# EAGLE design MCPAmplifier (EAGLE 9.0.1)
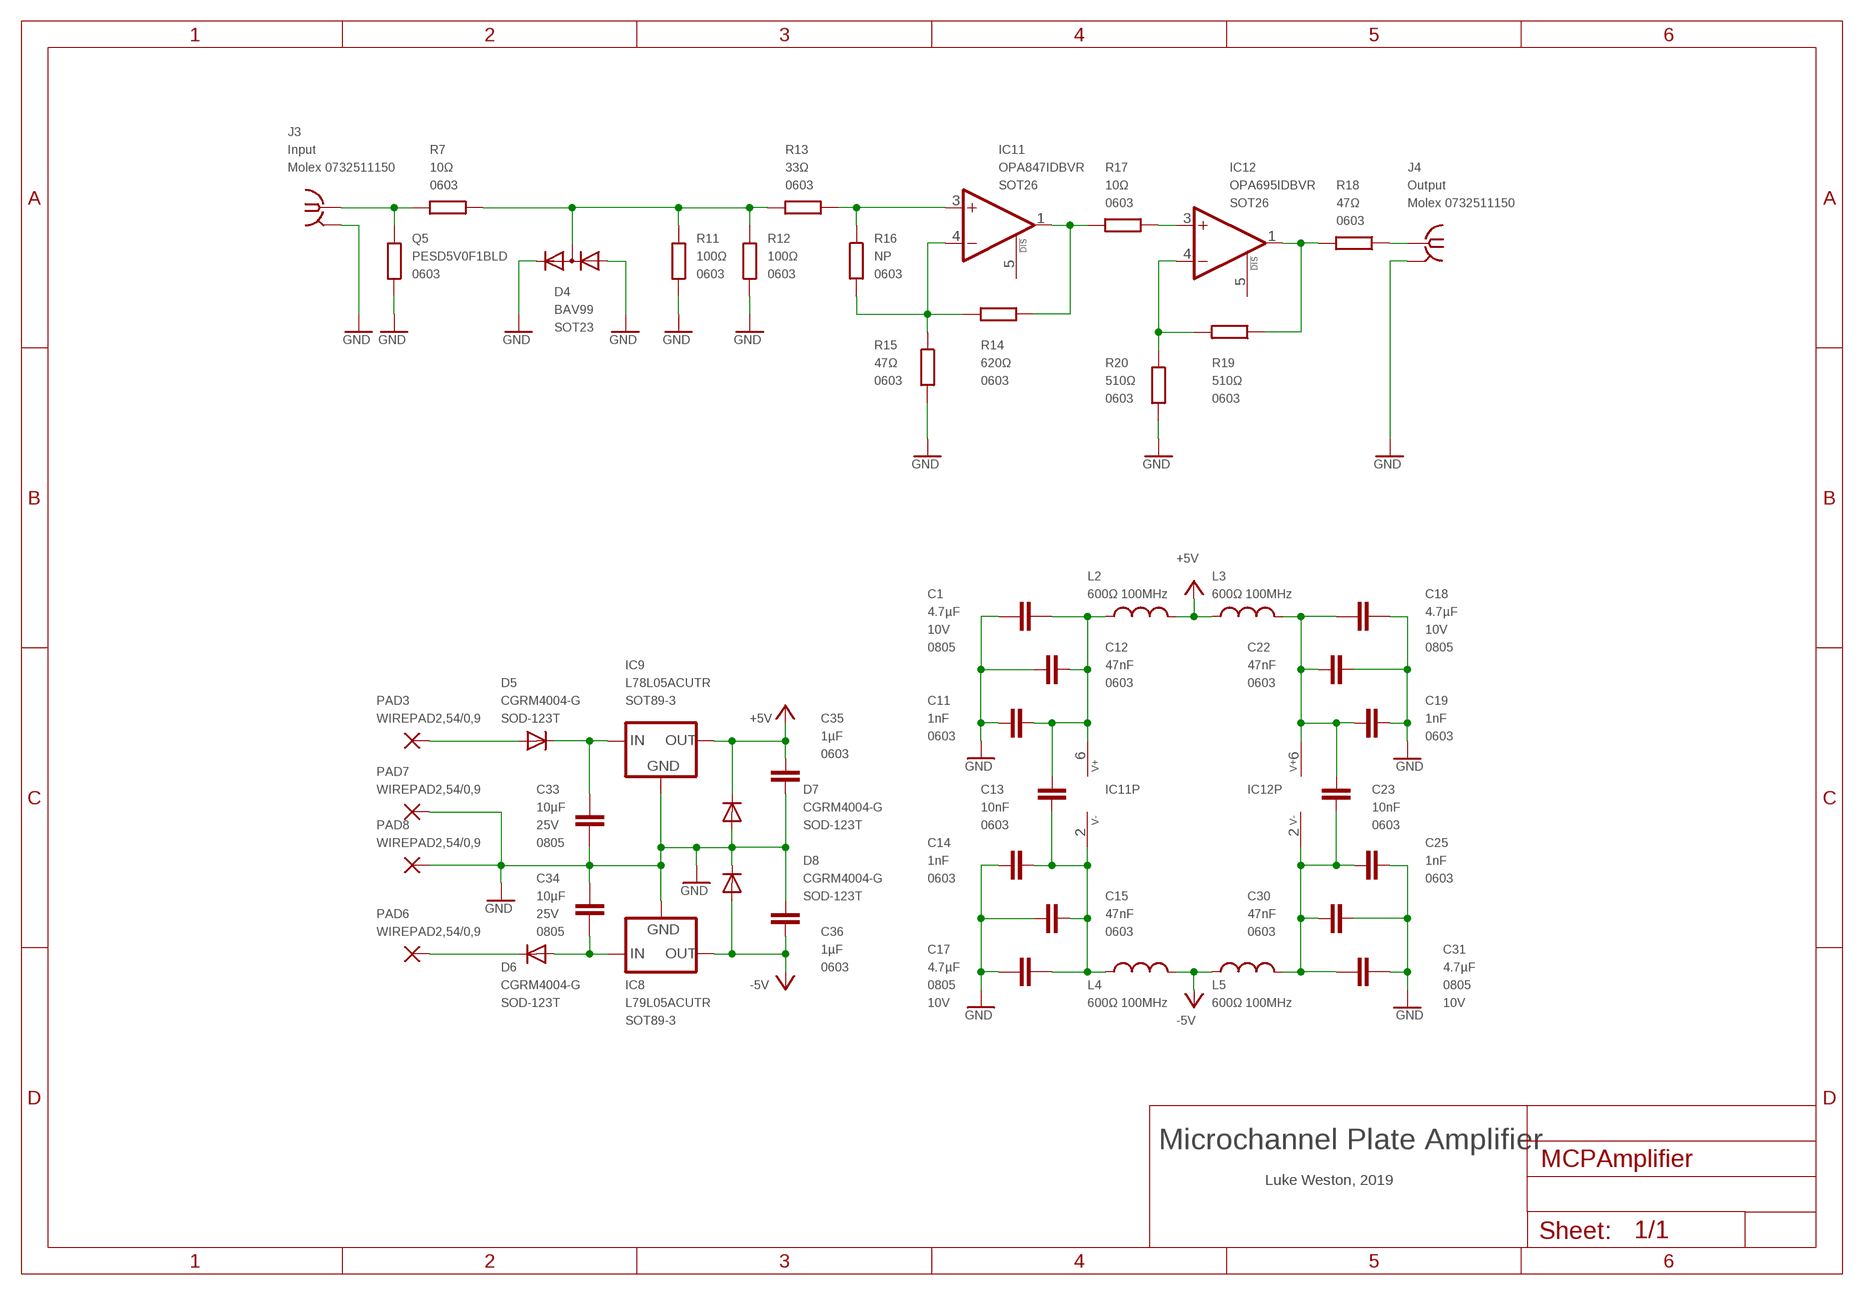
[diagram p0: schematic, sheet 1]

## Parts
C1  4.7µF  CAP0805  [0805]
C11  1nF  C0603  [0603]
C12  47nF  C0603  [0603]
C13  10nF  C0603  [0603]
C14  1nF  C0603  [0603]
C15  47nF  C0603  [0603]
C17  4.7µF  CAP0805  [0805]
C18  4.7µF  CAP0805  [0805]
C19  1nF  C0603  [0603]
C22  47nF  C0603  [0603]
C23  10nF  C0603  [0603]
C25  1nF  C0603  [0603]
C30  47nF  C0603  [0603]
C31  4.7µF  CAP0805  [0805]
C33  10µF  CAP0805  [0805]
C34  10µF  CAP0805  [0805]
C35  1µF  C0603  [0603]
C36  1µF  C0603  [0603]
D4  BAV99  BAV199  [SOT23]
D5  CGRM4004-G  [SOD-123_MINI-SMA]
D6  CGRM4004-G  [SOD-123_MINI-SMA]
D7  CGRM4004-G  [SOD-123_MINI-SMA]
D8  CGRM4004-G  [SOD-123_MINI-SMA]
IC8  L79L05ACUTR  79LXX-SOT89  [SOT89]
IC9  L78L05ACUTR  78LXX-SOT89  [SOT89]
IC11  OPA847IDBVR  OPA847DBV  [SOT23-6]
IC12  OPA695IDBVR  OPA847DBV  [SOT23-6]
J3  Input  SMA-142-0701-881/886  [J502-ND-142-0701-881/886]
J4  Output  SMA-142-0701-881/886  [J502-ND-142-0701-881/886]
L2  600Ω 100MHz  0402INDUCTOR  [0603]
L3  600Ω 100MHz  0402INDUCTOR  [0603]
L4  600Ω 100MHz  0402INDUCTOR  [0603]
L5  600Ω 100MHz  0402INDUCTOR  [0603]
PAD3  WIREPAD2,54/0,9  [2,54/0,9]
PAD6  WIREPAD2,54/0,9  [2,54/0,9]
PAD7  WIREPAD2,54/0,9  [2,54/0,9]
PAD8  WIREPAD2,54/0,9  [2,54/0,9]
Q5  PESD5V0F1BLD  R0603  [0603]
R7  10Ω  R0603  [0603]
R11  100Ω  R0603  [0603]
R12  100Ω  R0603  [0603]
R13  33Ω  R0603  [0603]
R14  620Ω  R0603  [0603]
R15  47Ω  R0603  [0603]
R16  NP  R0603  [0603]
R17  10Ω  R0603  [0603]
R18  47Ω  R0603  [0603]
R19  510Ω  R0603  [0603]
R20  510Ω  R0603  [0603]

## Nets
+5V: C35.1 D7.C IC9.1(OUT) L2.2 L3.1
-5V: C36.2 D8.A IC8.3(OUT) L4.2 L5.1
GND: C1.2 C11.2 C12.2 C14.2 C15.2 C17.2 C18.2 C19.2 C22.2 C25.2 C30.2 C31.2 C33.1 C34.2 C35.2 C36.1 D4.1(A) D4.2(C) D7.A D8.C IC8.1(GND) IC9.2(GND) J3.G@1 J3.G@2 J3.G@3 J3.G@4 J4.G@1 J4.G@2 J4.G@3 J4.G@4 PAD7.1(P) PAD8.1(P) Q5.1 R11.1 R12.1 R15.2 R20.2
N$8: C13.2 C14.1 C15.1 C17.1 IC11.2(P:V-) L4.1
N$13: D4.3(AC) R7.2 R11.2 R12.2 R13.2
N$14: J3.1 Q5.2 R7.1
N$15: IC11.3(+IN) R13.1 R16.1
N$16: IC11.4(-IN) R14.2 R15.1 R16.2
N$17: IC11.1(OUT) R14.1 R17.2
N$18: IC12.3(+IN) R17.1
N$19: IC12.4(-IN) R19.2 R20.1
N$20: IC12.1(OUT) R18.2 R19.1
N$21: J4.1 R18.1
N$23: C1.1 C11.1 C12.1 C13.1 IC11.6(P:V+) L2.1
N$25: C18.1 C19.1 C22.1 C23.1 IC12.6(P:V+) L3.2
N$26: C23.2 C25.1 C30.1 C31.1 IC12.2(P:V-) L5.2
N$27: D5.A PAD3.1(P)
N$28: C33.2 D5.C IC9.3(IN)
N$30: D6.C PAD6.1(P)
N$31: C34.1 D6.A IC8.2(IN)
Unconnected: IC11.5(DIS) IC12.5(DIS)

## Notes on the sheet
- Microchannel Plate Amplifier
- Luke Weston, 2019

## Library data of the parts
C1 C17 C18 C31 = IRSensor:CAP: Capacitor Standard 0603 ceramic capacitor, and 0.1" leaded capacitor.; PACKAGE: 0805; VOLTAGE: 10V
C11-C15 C19 C22 C23 C25 C30 C35 C36 = IRSensor:C; PACKAGE: 0603
C33 C34 = IRSensor:CAP: Capacitor Standard 0603 ceramic capacitor, and 0.1" leaded capacitor.; PACKAGE: 0805; VOLTAGE: 25V
D4 = diode:BAV199: DIODE low-leakage double diode; PACKAGE: SOT23
D5-D8 = diode:CGRM400*-G: Molded plasitc,JEDEC SOD-123/Mini SMA Source: Comchip CGRM4001-G.pdf; PACKAGE: SOD-123T
IC8 = v-reg-3:79LXX: VOLTAGE REGULATOR; PACKAGE: SOT89-3
IC9 = v-reg-3:78LXX: VOLTAGE REGULATOR; PACKAGE: SOT89-3
IC11 IC12 = op-amp:OPA847: OP-AMP Wideband, Ultra-Low Noise, Voltage-Feedback with Shutdown; PACKAGE: SOT26
J3 J4 = IRSensor:SMA-: SMA 50 Ohm End Launch Jack Receptacle - Round Contact Johnson Components Source: www.johnsoncomponents.com .. J502-ND.pdf; MF: JOHNSON COMPONENTS; MPN: 142-0701-881; OC_FARNELL: 1608603; OC_NEWARK: 08B906; SKU: Molex 0732511150
L2-L5 = freetronics-luke:0402INDUCTOR
PAD3 PAD6-PAD8 = IRSensor:WIREPAD: Wire PAD connect wire on PCB
Q5 R7 R11-R20 = IRSensor:R; PACKAGE: 0603

## Board
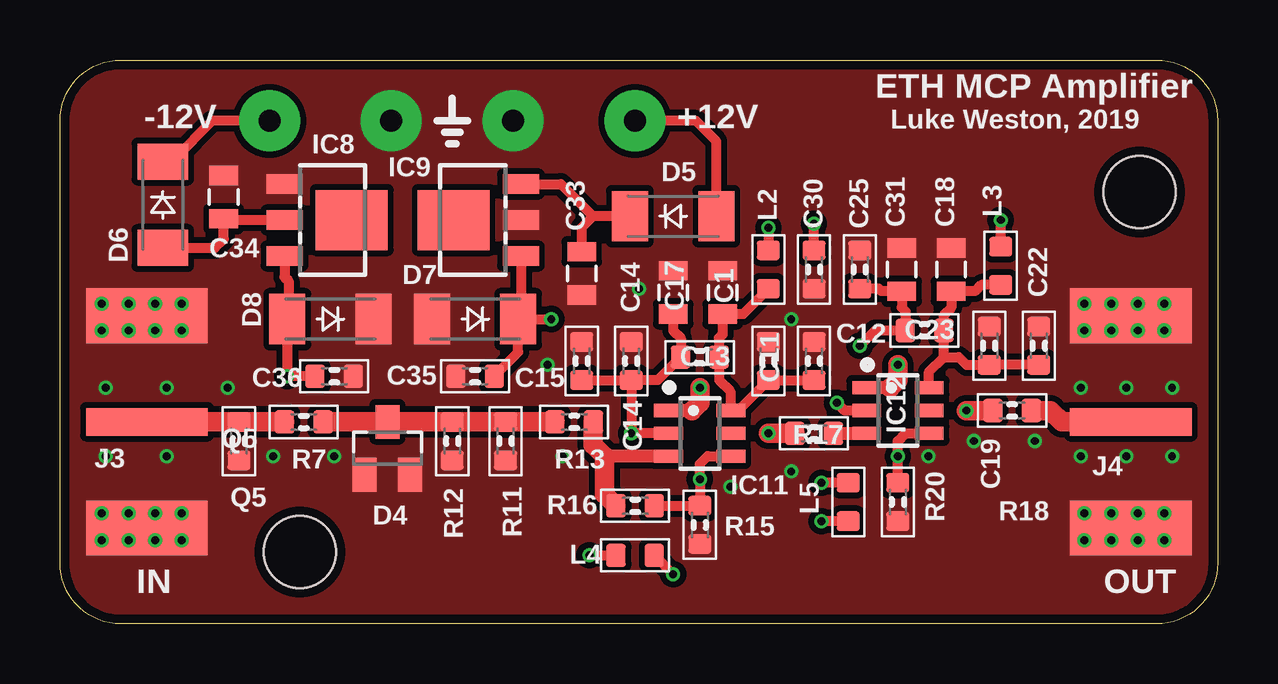
[diagram p1: board, top side]
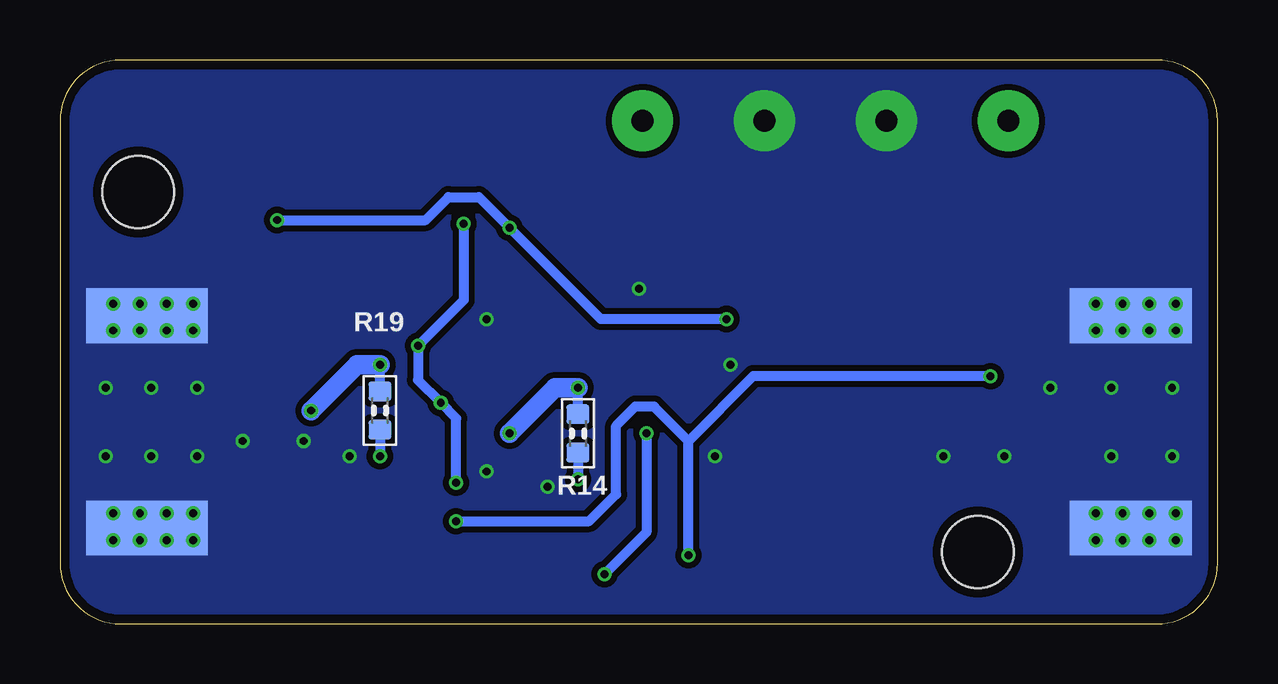
[diagram p2: board, bottom side, seen from below]

Size 48.26 x 23.5 mm. Coordinates in mm from the lower left corner, seen from the top.
Outline: 2.54,23.5 45.72,23.5 arc-90 48.26,20.95 48.26,2.54 arc-90 45.72,0 2.54,0 arc-90 0,2.54 0,20.95 arc-90 2.54,23.5
Copper layers (1*16): Top 0.035559375mm / dielectric 1.6mm / Bottom 0.035559375mm
Design rules "oshpark-2layer-tented": minimum track width 6mil, minimum drill 10mil, track to track 6mil, track to pad 6mil, pad to pad 6mil, via to via 6mil, smd to smd 6mil, copper to edge 15mil, drill to drill 6mil, minimum pad ring 5mil, minimum via ring 5mil, stop-mask expansion 2.5mil, vias tented up to drill 20mil, thermal gap 10mil
Holes 3 mm at 10,3 45,18

### Footprints (pad centres in the part's own frame; a part is rotated, then mirrored left to right if it is on the bottom)
0805 = smd 0.8 x 1.2: 1 -0.9,0; 2 0.9,0
0603 = smd 0.8 x 0.95: 1 -0.8,0; 2 0.8,0
SOT23 = smd 1 x 1.4: 1 -0.95,-1.1; 2 0.95,-1.1; 3 0,1.1
SOD-123_MINI-SMA = smd 1.5 x 2.1: A 1.8,0; C -1.8,0
SOT89 = smd 0.8 x 1.5: 1 -1.5,-1.75; 2 0,-1.75; 3 1.5,-1.75 | smd 2.5 x 3: 4 0,1.05
SOT23-6 = smd 0.55 x 1.2: 1 -0.95,-1.3; 2 0,-1.3; 3 0.95,-1.3; 4 0.95,1.3; 5 0,1.3; 6 -0.95,1.3
J502-ND-142-0701-881/886 = smd 5.08 x 1.143: 1 2.565,0 | smd 5.08 x 2.286: G@1 2.565,4.42; G@2 2.565,-4.42 | smd 5.08 x 2.286 bottom: G@3 2.565,4.42; G@4 2.565,-4.42
2,54/0,9 = drill 0.914 pad 2.54: 1 0,0

### Placement (x,y rotation side)
C1  27.62,13.81 90 top
C11  29.53,10.95 90 top
C12  31.43,10.95 90 top
C13  26.67,11.11 180 top
C14  23.81,10.95 90 top
C15  21.75,10.95 90 top
C17  25.56,13.81 90 top
C18  37.15,14.76 90 top
C19  38.73,11.59 90 top
C22  40.8,11.59 90 top
C23  36.04,12.22 180 top
C25  33.34,14.76 90 top
C30  31.43,14.76 270 top
C31  35.08,14.76 90 top
C33  21.75,14.61 90 top
C34  6.83,17.78 90 top
C35  17.3,10.32 180 top
C36  11.43,10.32 180 top
D4  13.65,7.31 0 top
D5  25.56,16.99 0 top
D6  4.29,17.46 270 top
D7  17.3,12.7 180 top
D8  11.27,12.7 180 top
IC8  11.11,16.83 270 top
IC9  17.46,16.83 90 top
IC11  26.67,7.94 270 top
IC12  34.92,8.89 270 top
J3  6.19,8.41 180 top
J4  42.07,8.41 0 top
L2  29.53,14.76 90 top
L3  39.21,14.92 270 top
L4  23.97,2.86 180 top
L5  32.86,5.08 90 top
PAD3  23.97,20.95 270 top
PAD6  8.73,20.95 270 top
PAD7  18.89,20.95 270 top
PAD8  13.81,20.95 270 top
Q5  7.46,7.61 90 top
R7  10.16,8.41 0 top
R11  18.57,7.61 90 top
R12  16.35,7.61 90 top
R13  21.43,8.41 180 top
R14  26.67,7.94 270 bottom
R15  26.67,4.13 270 top
R16  23.97,4.92 0 top
R17  31.43,7.94 180 top
R18  39.69,8.89 180 top
R19  34.92,8.89 270 bottom
R20  34.92,5.08 270 top

### Tracks (layer width: path | path; a pad name or v marks a point on that pad's centre or on a via)
+5V  (via drill 0.33)
  Top 0.254: 19.21,12.81 D7.C
  Top 0.406: IC9.1 19.21,12.81 | C35.1 19.1,11.32 D7.C v20.48,12.7 | v29.53,16.51 L2.2 | L3.1 v39.21,16.83
  Bottom 0.254: v29.52,16.51 v29.53,16.51
  Bottom 0.406: v39.21,16.83 33.02,16.83 32.07,17.78 30.8,17.78 v29.52,16.51 25.72,12.7 v20.48,12.7
-5V  (via drill 0.33)
  Top 0.254: 9.53,12.75 D8.A
  Top 0.406: IC8.3 9.36,14.45 9.53,14.29 9.53,12.75 | C36.2 v9.47,10.32 D8.A | v22.07,2.86 L4.2 | L5.1 v31.74,4.28
  Bottom 0.254: v31.74,4.29 v31.74,4.28
  Bottom 0.406: v31.74,4.28 26.2,4.28 25.08,5.4 25.08,8.26 24.29,9.05 23.5,9.05 22.07,7.62 | v9.47,10.32 19.37,10.32 22.07,7.62 | v22.07,2.86 22.07,7.62
GND  (via drill 0.33)
  other vias: 1.75,4.6 1.75,3.49 2.86,3.49 2.86,4.6 3.97,4.6 5.08,4.6 5.08,3.49 3.97,13.34 1.75,13.34 1.75,12.22 2.86,12.22 2.86,13.34 3.97,12.22 5.08,13.34 5.08,12.22 3.97,3.49 42.7,13.34 42.7,12.22 43.81,12.22 43.81,13.34 44.93,13.34 44.93,12.22 46.04,13.34 46.04,12.22 42.7,3.49 42.7,4.6 43.81,4.6 43.81,3.49 44.93,3.49 44.93,4.6 46.04,4.6 46.04,3.49 30.48,12.7 30.48,6.35 27.94,5.71 36.2,6.99 38.1,7.62 40.64,7.62 42.55,9.84 42.55,6.99 44.45,6.99 44.45,9.84 46.35,9.84 46.35,6.99 24.13,13.97 20.32,10.79 20.95,6.99 8.89,6.99 11.43,6.99 6.99,9.84 4.45,9.84 4.45,6.99 1.91,6.99 1.91,9.84
  pour Top (isolate 0.254, no thermals): 0,23.5 48.26,23.5 48.26,0 0,0
  pour Bottom (isolate 0.254, no thermals): 0,0 48.26,0 48.26,23.5 0,23.5
N$8  (via drill 0.33)
  Top 0.254: C13.2 | L4.1
  Top 0.406: C15.1 C14.1 | C13.2 24.91,10.15 C14.1 | C17.1 25.56,12.22 25.88,11.91 C13.2 | L4.1 v25.56,2.06 | IC11.2 v23.81,7.94 C14.1
  Bottom 0.406: v23.81,7.94 23.81,3.81 v25.56,2.06
N$13
  Top 0.254: R12.2 16.67,8.41 | 11.12,8.41 R7.2
  Top 0.813: 16.67,8.41 R11.2 R13.2 | 11.12,8.41 D4.3 16.67,8.41
N$14
  Top 0.813: J3.1 Q5.2 R7.1
N$15
  Top 0.254: IC11.3 | R16.1 | R13.1 | 22.7,6.99
  Top 0.533: IC11.3 22.7,6.99
  Top 0.813: 22.7,6.99 22.23,7.46 R13.1 | R16.1 22.7,5.39 22.7,6.99
N$16  (via drill 0.33)
  Top 0.254: R15.1
  Top 0.406: IC11.4 26.99,6.99 26.67,6.67 v26.67,6.03 R15.1 | R16.2 R15.1
  Bottom 0.406: R14.2 v26.67,6.03
N$17  (via drill 0.33)
  Top 0.533: 26.35,8.89 IC11.1
  Top 0.813: v26.67,9.84 26.67,9.21 26.35,8.89 | v29.53,7.94 R17.2
  Bottom 0.406: R14.1 v26.67,9.84
  Bottom 0.813: v26.67,9.84 27.62,9.84 v29.53,7.94
N$18
  Top 0.254: IC12.3
  Top 0.533: R17.1 IC12.3
N$19  (via drill 0.33)
  Top 0.406: IC12.4 35.24,7.94 34.92,7.62 v34.92,6.99 R20.1
  Bottom 0.406: R19.2 v34.92,6.99
N$20  (via drill 0.33)
  Top 0.533: 34.6,9.84 IC12.1
  Top 0.813: v34.92,10.79 34.92,10.16 34.6,9.84 | R18.2 v37.78,8.89
  Bottom 0.406: R19.1 v34.92,10.79
  Bottom 0.813: v34.92,10.79 35.88,10.79 v37.78,8.89
N$21
  Top 0.813: J4.1 41.75,8.41 41.27,8.89 R18.1
N$23
  Top 0.254: IC11.6 27.94,8.89 28.26,8.89 | C13.1
  Top 0.406: 28.26,8.89 C11.1 C12.1 | 27.94,8.89 27.94,9.69 27.47,10.15 C13.1 | C13.1 27.46,11.91 27.62,12.06 C1.1 28.48,12.91 L2.1
N$25
  Top 0.254: C23.1
  Top 0.406: IC12.6 36.23,10.51 36.84,11.12 | 36.84,11.12 C23.1 | 36.84,11.12 37.46,11.12 37.79,10.79 C19.1 C22.1 | C23.1 36.83,12.86 37.15,13.18 C18.1 38.15,13.86 38.41,14.12 L3.2
N$26  (via drill 0.33)
  Top 0.254: C23.2 | C25.1
  Top 0.406: v32.38,9.21 32.7,8.89 IC12.2 | C23.2 35.24,13.02 35.08,13.18 C31.1 34.24,13.86 34.13,13.97 C25.1 | C30.1 v31.43,16.67 | C23.2 33.97,12.22 v33.34,11.59 | L5.2 v31.74,5.88
  Bottom 0.406: v31.74,5.88 31.74,8.57 v32.38,9.21 33.34,10.16 v33.34,11.59 31.43,13.49 v31.43,16.67
N$27
  Top 0.406: D5.A 27.36,20.11 26.51,20.95 PAD3.1
N$28
  Top 0.406: D5.C 22.23,16.99 | 22.23,16.99 21.75,16.51 C33.2 | IC9.3 20.88,18.33 22.23,16.99
N$30
  Top 0.406: D6.C 4.29,19.37 4.76,19.37 6.35,20.95 PAD6.1
N$31
  Top 0.254: 6.83,16.83 C34.1
  Top 0.406: D6.A 6.46,15.66 6.83,16.03 6.83,16.83 IC8.2

### Text on the board
tPlace: ETH MCP Amplifier | -12V | +12V | Luke Weston, 2019 | IN | OUT
tValues: Ferrite